# Altium schematic sheet Volant5.SchDoc
size A4
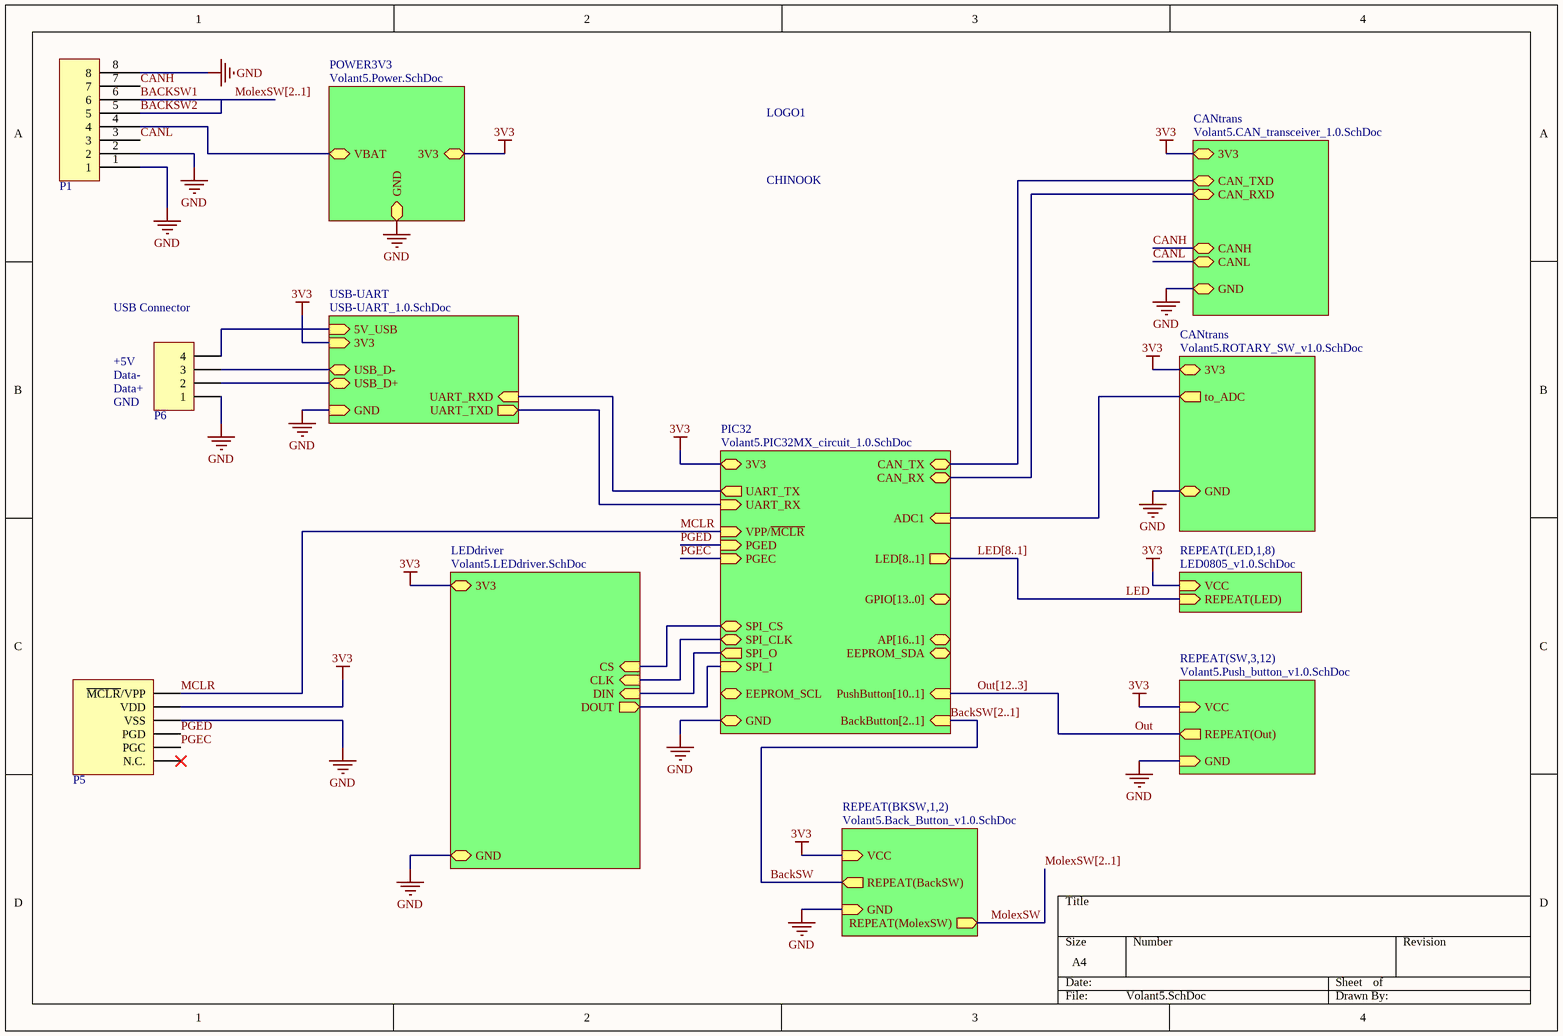
[diagram p0: Volant5.SchDoc]

## Parts
LOGO1  CHINOOK  [LOGO-CHINOOK]
P1  CON - MOLEX 8POS  [CON-MOLEX Mini Jr 8pin - RA]  (value not drawn)
P5  CON - HEADER PROG  [CON-PROG-PIC]  (value not drawn)
P6  CON - HEADER 1X4  [CON-HEADER-1X4]  (value not drawn)

## Sub-sheets
CANtrans = Volant5.CAN_transceiver_1.0.SchDoc: CAN_RXD (bidir), CAN_TXD (bidir), CANH (bidir), CANL (bidir), 3V3, GND
CANtrans = Volant5.ROTARY_SW_v1.0.SchDoc: to_ADC (out), GND, 3V3
LEDdriver = Volant5.LEDdriver.SchDoc: 3V3, GND, CLK (in), DIN (in), DOUT (out), CS (in)
PIC32 = Volant5.PIC32MX_circuit_1.0.SchDoc: 3V3, GND, CAN_RX (bidir), CAN_TX (bidir), UART_TX (out), UART_RX (in), AP[16..1] (bidir), GPIO[13..0] (bidir), EEPROM_SCL (bidir), EEPROM_SDA (bidir), PGED (in), PGEC (in), LED[8..1] (out), VPP/~{MCLR} (in), SPI_O (out), SPI_I (in), SPI_CLK, PushButton[10..1] (in), SPI_CS, BackButton[2..1] (in), ADC1 (in)
POWER3V3 = Volant5.Power.SchDoc: 3V3, GND, VBAT
REPEAT(BKSW,1,2) = Volant5.Back_Button_v1.0.SchDoc: REPEAT(BackSW) (out), VCC (in), GND (in), REPEAT(MolexSW) (out)
REPEAT(LED,1,8) = LED0805_v1.0.SchDoc: VCC (in), REPEAT(LED) (in)
REPEAT(SW,3,12) = Volant5.Push_button_v1.0.SchDoc: REPEAT(Out) (out), VCC (in), GND (in)
USB-UART = USB-UART_1.0.SchDoc: 3V3 (in), GND (in), UART_RXD (in), UART_TXD (out), 5V_USB (in), USB_D- (bidir), USB_D+ (bidir)

## Nets
3V3: P5.2(VDD) ; sheet POWER3V3/3V3, sheet PIC32/3V3, sheet CANtrans/3V3, sheet REPEAT(SW,3,12)/VCC, sheet REPEAT(LED,1,8)/VCC, sheet LEDdriver/3V3, sheet USB-UART/3V3, sheet REPEAT(BKSW,1,2)/VCC, sheet CANtrans/3V3
GND: P1.1 P1.2 P1.8 P5.3(VSS) P6.1 ; sheet POWER3V3/GND, sheet PIC32/GND, sheet CANtrans/GND, sheet REPEAT(SW,3,12)/GND, sheet LEDdriver/GND, sheet USB-UART/GND, sheet REPEAT(BKSW,1,2)/GND, sheet CANtrans/GND
BackSW: sheet REPEAT(BKSW,1,2)/REPEAT(BackSW)
BACKSW1: P1.6
BACKSW2: P1.5
CANH: P1.7 ; sheet CANtrans/CANH
CANL: P1.3 ; sheet CANtrans/CANL
LED: sheet REPEAT(LED,1,8)/REPEAT(LED)
MCLR: P5.1(~{MCLR}/VPP) ; sheet PIC32/VPP/~{MCLR}
MolexSW: sheet REPEAT(BKSW,1,2)/REPEAT(MolexSW)
Out: sheet REPEAT(SW,3,12)/REPEAT(Out)
PGEC: P5.5(PGC) ; sheet PIC32/PGEC
PGED: P5.4(PGD) ; sheet PIC32/PGED
NetP1_4: P1.4 ; sheet POWER3V3/VBAT
NetP6_2: P6.2 ; sheet USB-UART/USB_D+
NetP6_3: P6.3 ; sheet USB-UART/USB_D-
NetP6_4: P6.4 ; sheet USB-UART/5V_USB
(unnamed): sheet PIC32/CAN_RX, sheet CANtrans/CAN_RXD
(unnamed): sheet PIC32/CAN_TX, sheet CANtrans/CAN_TXD
(unnamed): sheet PIC32/UART_TX, sheet USB-UART/UART_RXD
(unnamed): sheet PIC32/UART_RX, sheet USB-UART/UART_TXD
(unnamed): sheet PIC32/SPI_O, sheet LEDdriver/DIN
(unnamed): sheet PIC32/SPI_I, sheet LEDdriver/DOUT
(unnamed): sheet PIC32/SPI_CLK, sheet LEDdriver/CLK
(unnamed): sheet PIC32/SPI_CS, sheet LEDdriver/CS
(unnamed): sheet PIC32/ADC1, sheet CANtrans/to_ADC

Not connected (* = marked no-connect by the designer): P5 6(N.C.)*

## Buses and harness runs
bus BackSW[2..1] = sheet PIC32/BackButton[2..1]
bus LED[8..1] = sheet PIC32/LED[8..1]
bus MolexSW[2..1]
bus Out[12..3] = sheet PIC32/PushButton[10..1]

## Notes on the sheet
- (near P6) USB Connector
- +5V
- (near P6) Data-
- (near P6) Data+
- GND

## Library data of the parts
LOGO1 = LOGO - FOOTPRINT
P1 = CON - MOLEX 8POS: Mini-Fit Jr 8pin; (FLIED A): *; (FLIED B): *; (FLIED C): *; Manufacturer: MOLEX; Supplier 1: Digi-Key; Supplier Part Number 1: A30617-ND
P5 = CON - PROG HEADER 6: MICROCHIP CONNECTOR; (FLIED A): *; (FLIED B): *; (FLIED C): *; Manufacturer: *; Supplier 1: Digi-Key; Supplier Part Number 1: 609-3263-ND
P6 = CON - HEADER 1X4: 100mil header 1 row 4pins; Manufacturer: *; (FIELD A): *; (FIELD B): *; (FIELD C): *; Supplier 1: Digi-Key; Supplier Part Number 1: S1011EC-04-ND